# EAGLE schematic EB_Device (EAGLE 9.6.1)
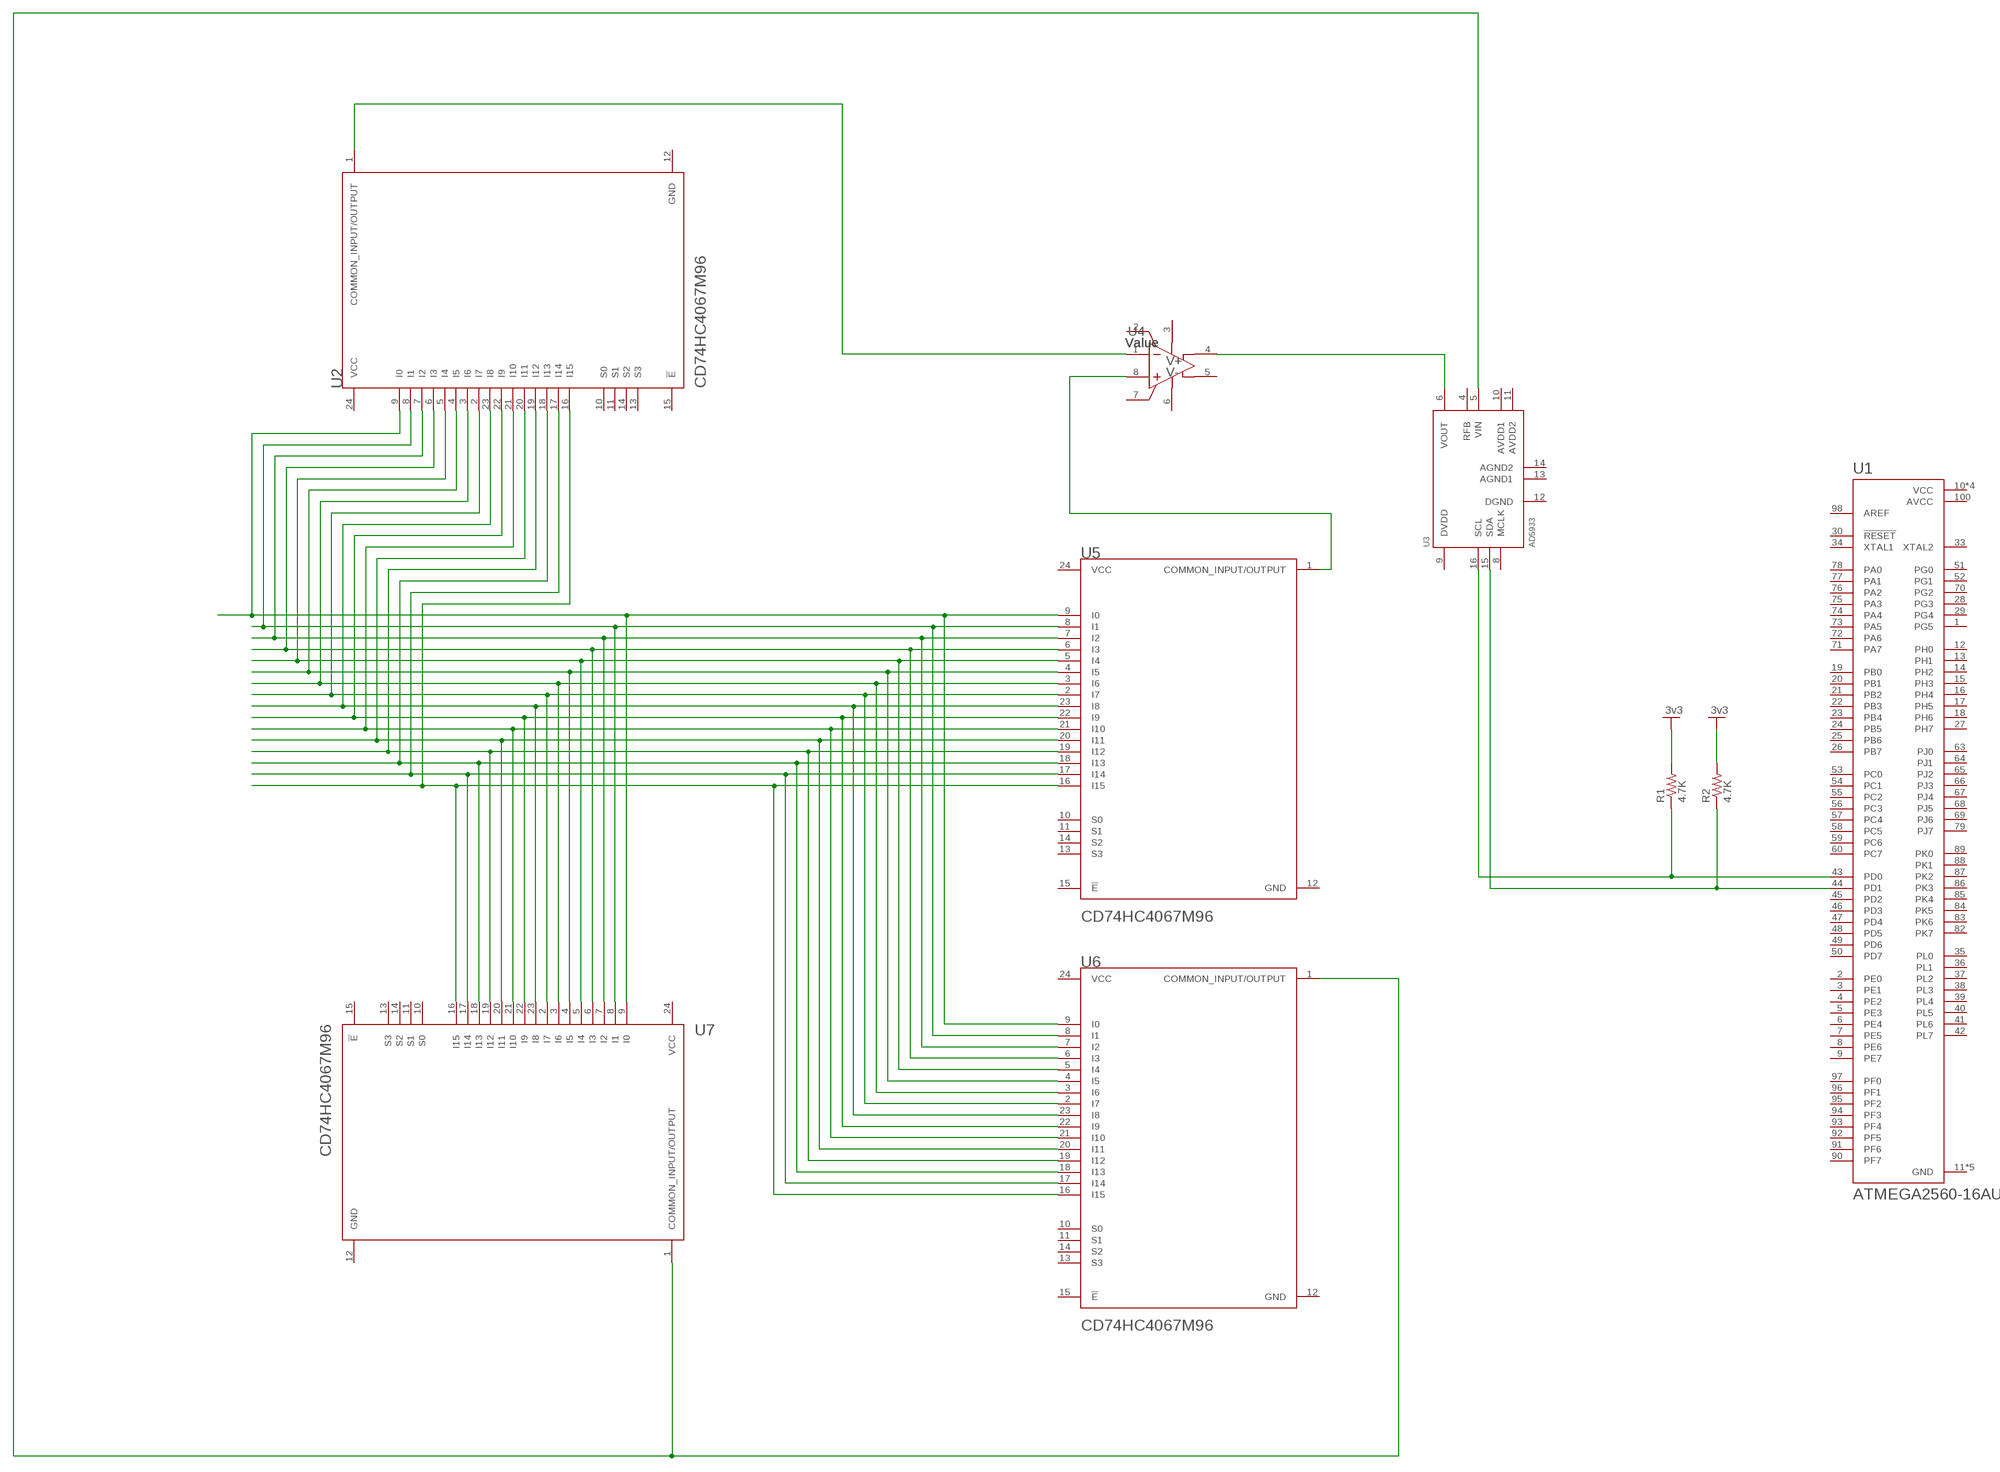
[diagram p0: schematic, sheet 1]

## Parts
R1  4.7K  R-US_0204/2V  [0204V]
R2  4.7K  R-US_0204/2V  [0204V]
U1  ATMEGA2560-16AU  [QFP50P1600X1600X120-100N]
U2  TEXAS_INSTRUMENTS_CD74HC4067M96TEXAS_INSTRUMENTS_CD74HC4067M96_0_0  [TEXAS_INSTRUMENTS_CD74HC4067M96_0]
U3  AD5933  [SSOP16]
U4  Value  THS4561IDGKT  [DGK0008A_N]
U5  TEXAS_INSTRUMENTS_CD74HC4067M96TEXAS_INSTRUMENTS_CD74HC4067M96_0_0  [TEXAS_INSTRUMENTS_CD74HC4067M96_0]
U6  TEXAS_INSTRUMENTS_CD74HC4067M96TEXAS_INSTRUMENTS_CD74HC4067M96_0_0  [TEXAS_INSTRUMENTS_CD74HC4067M96_0]
U7  TEXAS_INSTRUMENTS_CD74HC4067M96TEXAS_INSTRUMENTS_CD74HC4067M96_0_0  [TEXAS_INSTRUMENTS_CD74HC4067M96_0]

## Nets
GND: R1.2 R2.2 ; supply symbol labelled 3v3
N$1: U2.9(I0) U5.9(I0) U6.9(I0) U7.9(I0)
N$2: U2.2(I7) U2.3(I6) U2.4(I5) U2.5(I4) U2.6(I3) U2.7(I2) U2.8(I1) U2.16(I15) U2.17(I14) U2.18(I13) U2.19(I12) U2.20(I11) U2.21(I10) U2.22(I9) U2.23(I8) U5.2(I7) U5.3(I6) U5.4(I5) U5.5(I4) U5.6(I3) U5.7(I2) U5.8(I1) U5.16(I15) U5.17(I14) U5.18(I13) U5.19(I12) U5.20(I11) U5.21(I10) U5.22(I9) U5.23(I8) U6.2(I7) U6.3(I6) U6.4(I5) U6.5(I4) U6.6(I3) U6.7(I2) U6.8(I1) U6.16(I15) U6.17(I14) U6.18(I13) U6.19(I12) U6.20(I11) U6.21(I10) U6.22(I9) U6.23(I8) U7.2(I7) U7.3(I6) U7.4(I5) U7.5(I4) U7.6(I3) U7.7(I2) U7.8(I1) U7.16(I15) U7.17(I14) U7.18(I13) U7.19(I12) U7.20(I11) U7.21(I10) U7.22(I9) U7.23(I8)
N$3: U2.1(COMMON_INPUT/OUTPUT) U4.1(VIN-)
N$4: U4.8(VIN+) U5.1(COMMON_INPUT/OUTPUT)
N$5: U3.6(VOUT) U4.4(VOUT+)
N$6: U3.5(VIN) U6.1(COMMON_INPUT/OUTPUT) U7.1(COMMON_INPUT/OUTPUT)
N$7: R2.1 U1.44(PD1) U3.15(SDA)
N$8: R1.1 U1.43(PD0) U3.16(SCL)
Unconnected: U1.1(PG5) U1.2(PE0) U1.3(PE1) U1.4(PE2) U1.5(PE3) U1.6(PE4) U1.7(PE5) U1.8(PE6) U1.9(PE7) U1.12(PH0) U1.13(PH1) U1.14(PH2) U1.15(PH3) U1.16(PH4) U1.17(PH5) U1.18(PH6) U1.19(PB0) U1.20(PB1) U1.21(PB2) U1.22(PB3) U1.23(PB4) U1.24(PB5) U1.25(PB6) U1.26(PB7) U1.27(PH7) U1.28(PG3) U1.29(PG4) U1.30(!RESET) U1.33(XTAL2) U1.34(XTAL1) U1.35(PL0) U1.36(PL1) U1.37(PL2) U1.38(PL3) U1.39(PL4) U1.40(PL5) U1.41(PL6) U1.42(PL7) U1.45(PD2) U1.46(PD3) U1.47(PD4) U1.48(PD5) U1.49(PD6) U1.50(PD7) U1.51(PG0) U1.52(PG1) U1.53(PC0) U1.54(PC1) U1.55(PC2) U1.56(PC3) U1.57(PC4) U1.58(PC5) U1.59(PC6) U1.60(PC7) U1.63(PJ0) U1.64(PJ1) U1.65(PJ2) U1.66(PJ3) U1.67(PJ4) U1.68(PJ5) U1.69(PJ6) U1.70(PG2) U1.71(PA7) U1.72(PA6) U1.73(PA5) U1.74(PA4) U1.75(PA3) U1.76(PA2) U1.77(PA1) U1.78(PA0) U1.79(PJ7) U1.82(PK7) U1.83(PK6) U1.84(PK5) U1.85(PK4) U1.86(PK3) U1.87(PK2) U1.88(PK1) U1.89(PK0) U1.90(PF7) U1.91(PF6) U1.92(PF5) U1.93(PF4) U1.94(PF3) U1.95(PF2) U1.96(PF1) U1.97(PF0) U1.98(AREF) U2.10(S0) U2.11(S1) U2.13(S3) U2.14(S2) U2.15(!E!) U3.4(RFB) U3.8(MCLK) U3.9(DVDD) U3.10(AVDD1) U3.11(AVDD2) U3.12(DGND) U3.13(AGND1) U3.14(AGND2) U4.2(VOCM) U4.5(VOUT-) U4.7(PD_N) U5.10(S0) U5.11(S1) U5.13(S3) U5.14(S2) U5.15(!E!) U6.10(S0) U6.11(S1) U6.13(S3) U6.14(S2) U6.15(!E!) U7.10(S0) U7.11(S1) U7.13(S3) U7.14(S2) U7.15(!E!)

## Power pins joined to a net without a drawn wire
AVCC: U1.100(AVCC)
GND: U1.11(GND) U1.32(GND) U1.62(GND) U1.81(GND) U1.99(GND) U2.12(GND) U5.12(GND) U6.12(GND) U7.12(GND)
VCC: U1.10(VCC) U1.31(VCC) U1.61(VCC) U1.80(VCC) U2.24(VCC) U5.24(VCC) U6.24(VCC) U7.24(VCC)
VS+: U4.3(VS+)
VS-: U4.6(VS-)

## Library data of the parts
R1 R2 = adafruit:R-US_: RESISTOR, American symbol
U1 = ATMEGA2560-16AU:ATMEGA2560-16AU: ATmega Series 16 MHz 256 KB Flash 8 KB SRAM 8-Bit Microcontroller - TQFP-100 Check prices <https://pricing.snapeda.com/parts/ATMEGA2560-16AU/Microchip/view-part?ref=eda>; AVAILABILITY: Good; DESCRIPTION: AVR AVR® ATmega Microcontroller IC 8-Bit 16MHz 256KB (128K x 16) FLASH 100-TQFP (14x14); MF: Microchip; MP: ATMEGA2560-16AU; PACKAGE: TQFP-100 Microchip; PRICE: None; PURCHASE-URL: https://pricing.snapeda.com/search/part/ATMEGA2560-16AU/?ref=eda
U2 U5-U7 = Texas Instruments - CD74HC4067M96:TEXAS_INSTRUMENTS_CD74HC4067M96: High-speed CMOS 16-channel analog multiplexer/demultiplexer 24-SOIC -55 to 125; AMBIENT_TEMPERATURE_RANGE_HIGH: +125°C; AMBIENT_TEMPERATURE_RANGE_LOW: -55°C; AUTOMOTIVE: No; CENTROID_NOT_SPECIFIED: No; DATASHEET: http://www.ti.com/lit/ds/symlink/cd74hc4067.pdf; DEVICE_CLASS_L1: Integrated Circuits (ICs); DEVICE_CLASS_L2: Logic ICs; DEVICE_CLASS_L3: Multiplexers; DIGIKEY_DESCRIPTION: IC MUX/DEMUX 1X16 24SOIC; DIGIKEY_PART_NUMBER: 296-29408-1-ND; FOOTPRINT_PARAMETERS_1: {"fp_type":"SOIC_narrow","params":{"N":{"nom":24,"long name":"Number of leads","min":null,"max":null,"short name":"N","type":"count"},"A":{"nom":false,"long name":"Height","min":false,"max":2650000,"short name":"A","type":"measurement"},"A1":{"nom":false,"long name":"Package clearance","min":100000,"max":300000,"short name":"A1","type":"measurement"},"A2":{"nom":false,"long name":"Package height","min":false,"max":2550000,"short name":"A2","type":"measurement"},"D":{"nom":false,"long name":"Package length","min":15200000,"max":15600000,"short name":"D","type":"measurement"},"E":{"nom":false,"long name":"Width w/ leads","min":9970000,"max":10630000,"short name":"E","type":"measurement"},"E1":{"nom":false,"long name":"Package width","min":7400000,"max":7600000,"short name":"E1","type":"measurement"},"B":{"nom":false,"long name":"Lead width","min":310000,"max":510000,"short name":"B","type":"measurement"},"C":{"nom":false,"long name":"Lead thickness","min":200000,"max":330000,"short name":"C","type":"measurement"},"e":{"nom":1270000,"long name":"Lead pitch","min":null,"max":null,"short name":"e","type":"measurement"},"L":{"nom":false,"long name":"Lead foot length","min":400000,"max":1270000,"short name":"L","type":"measurement"},"PHI":{"nom":false,"long name":"Lead foot angle","min":0,"max":8000000,"short name":"PHI","type":"measurement"},"HT":{"default":"No","long name":"Thermal pad","type":"multichoiceparent","short name":"HT","children":[]},"offset x":{"nom":0,"long name":"X Center offset","min":null,"max":null,"short name":"offset x","type":"measurement"},"offset y":{"nom":0,"long name":"Y Center offset","min":null,"max":null,"short name":"offset y","type":"measurement"},"LS":{"default":"Rounded rectangle","long name":"Land shape","type":"multichoice","short name":"LS"},"LS1":{"default":"Rectangle","long name":"Land shape (Pin 1)","type":"multichoice","short name":"LS1"},"solder toe":{"nom":550000,"long name":"Solder fillet (toe)","min":null,"max":null,"short name":"solder toe","type":"fixedmeasurement"},"solder heel":{"nom":450000,"long name":"Solder fillet (heel)","min":null,"max":null,"short name":"solder heel","type":"fixedmeasurement"},"solder side":{"nom":50000,"long name":"Solder fillet (side)","min":null,"max":null,"short name":"solder side","type":"fixedmeasurement"},"courtyard":{"nom":500000,"long name":"Courtyard","min":null,"max":null,"short name":"courtyard","type":"fixedmeasurement"},"SF":{"default":"A","long name":"Packing level","type":"multichoiceparent","short name":"SF","help":"http://support.upverter.com/customer/portal/articles/978783-what-is-a-footprint-packing-level","children":["solder toe","solder heel","solder side","courtyard"]}}}; FOOTPRINT_PARAMETERS_2: {"fp_type":"SOIC_narrow","params":{"N":{"nom":24,"long name":"Number of leads","min":null,"max":null,"short name":"N","type":"count"},"A":{"nom":false,"long name":"Height","min":false,"max":2650000,"short name":"A","type":"measurement"},"A1":{"nom":false,"long name":"Package clearance","min":100000,"max":300000,"short name":"A1","type":"measurement"},"A2":{"nom":false,"long name":"Package height","min":false,"max":2550000,"short name":"A2","type":"measurement"},"D":{"nom":false,"long name":"Package length","min":15200000,"max":15600000,"short name":"D","type":"measurement"},"E":{"nom":false,"long name":"Width w/ leads","min":9970000,"max":10630000,"short name":"E","type":"measurement"},"E1":{"nom":false,"long name":"Package width","min":7400000,"max":7600000,"short name":"E1","type":"measurement"},"B":{"nom":false,"long name":"Lead width","min":310000,"max":510000,"short name":"B","type":"measurement"},"C":{"nom":false,"long name":"Lead thickness","min":200000,"max":330000,"short name":"C","type":"measurement"},"e":{"nom":1270000,"long name":"Lead pitch","min":null,"max":null,"short name":"e","type":"measurement"},"L":{"nom":false,"long name":"Lead foot length","min":400000,"max":1270000,"short name":"L","type":"measurement"},"PHI":{"nom":false,"long name":"Lead foot angle","min":0,"max":8000000,"short name":"PHI","type":"measurement"},"HT":{"default":"No","long name":"Thermal pad","type":"multichoiceparent","short name":"HT","children":[]},"offset x":{"nom":0,"long name":"X Center offset","min":null,"max":null,"short name":"offset x","type":"measurement"},"offset y":{"nom":0,"long name":"Y Center offset","min":null,"max":null,"short name":"offset y","type":"measurement"},"LS":{"default":"Rounded rectangle","long name":"Land shape","type":"multichoice","short name":"LS"},"LS1":{"default":"Rectangle","long name":"Land shape (Pin 1)","type":"multichoice","short name":"LS1"},"solder toe":{"nom":350000,"long name":"Solder fillet (toe)","min":null,"max":null,"short name":"solder toe","type":"fixedmeasurement"},"solder heel":{"nom":350000,"long name":"Solder fillet (heel)","min":null,"max":null,"short name":"solder heel","type":"fixedmeasurement"},"solder side":{"nom":30000,"long name":"Solder fillet (side)","min":null,"max":null,"short name":"solder side","type":"fixedmeasurement"},"courtyard":{"nom":250000,"long name":"Courtyard","min":null,"max":null,"short name":"courtyard","type":"fixedmeasurement"},"SF":{"default":"B","long name":"Packing level","type":"multichoiceparent","short name":"SF","help":"http://support.upverter.com/customer/portal/articles/978783-what-is-a-footprint-packing-level","children":["solder toe","solder heel","solder side","courtyard"]}}}; FOOTPRINT_PARAMETERS_3: {"fp_type":"SOIC_narrow","params":{"N":{"nom":24,"long name":"Number of leads","min":null,"max":null,"short name":"N","type":"count"},"A":{"nom":false,"long name":"Height","min":false,"max":2650000,"short name":"A","type":"measurement"},"A1":{"nom":false,"long name":"Package clearance","min":100000,"max":300000,"short name":"A1","type":"measurement"},"A2":{"nom":false,"long name":"Package height","min":false,"max":2550000,"short name":"A2","type":"measurement"},"D":{"nom":false,"long name":"Package length","min":15200000,"max":15600000,"short name":"D","type":"measurement"},"E":{"nom":false,"long name":"Width w/ leads","min":9970000,"max":10630000,"short name":"E","type":"measurement"},"E1":{"nom":false,"long name":"Package width","min":7400000,"max":7600000,"short name":"E1","type":"measurement"},"B":{"nom":false,"long name":"Lead width","min":310000,"max":510000,"short name":"B","type":"measurement"},"C":{"nom":false,"long name":"Lead thickness","min":200000,"max":330000,"short name":"C","type":"measurement"},"e":{"nom":1270000,"long name":"Lead pitch","min":null,"max":null,"short name":"e","type":"measurement"},"L":{"nom":false,"long name":"Lead foot length","min":400000,"max":1270000,"short name":"L","type":"measurement"},"PHI":{"nom":false,"long name":"Lead foot angle","min":0,"max":8000000,"short name":"PHI","type":"measurement"},"HT":{"default":"No","long name":"Thermal pad","type":"multichoiceparent","short name":"HT","children":[]},"offset x":{"nom":0,"long name":"X Center offset","min":null,"max":null,"short name":"offset x","type":"measurement"},"offset y":{"nom":0,"long name":"Y Center offset","min":null,"max":null,"short name":"offset y","type":"measurement"},"LS":{"default":"Rounded rectangle","long name":"Land shape","type":"multichoice","short name":"LS"},"LS1":{"default":"Rectangle","long name":"Land shape (Pin 1)","type":"multichoice","short name":"LS1"},"solder toe":{"nom":150000,"long name":"Solder fillet (toe)","min":null,"max":null,"short name":"solder toe","type":"fixedmeasurement"},"solder heel":{"nom":250000,"long name":"Solder fillet (heel)","min":null,"max":null,"short name":"solder heel","type":"fixedmeasurement"},"solder side":{"nom":10000,"long name":"Solder fillet (side)","min":null,"max":null,"short name":"solder side","type":"fixedmeasurement"},"courtyard":{"nom":100000,"long name":"Courtyard","min":null,"max":null,"short name":"courtyard","type":"fixedmeasurement"},"SF":{"default":"C","long name":"Packing level","type":"multichoiceparent","short name":"SF","help":"http://support.upverter.com/customer/portal/articles/978783-what-is-a-footprint-packing-level","children":["solder toe","solder heel","solder side","courtyard"]}}}; FOOTPRINT_VARIANT_NAME_0: Recommended_Land_Pattern; FOOTPRINT_VARIANT_NAME_1: IPC_A; FOOTPRINT_VARIANT_NAME_2: IPC_B; FOOTPRINT_VARIANT_NAME_3: IPC_C; HEIGHT: 2.65mm; IPC_LAND_PATTERN_NAME: SOIC127P1030X265-24; LEAD_FREE: Yes; LOGIC_FUNCTION_DESC: Non-Inverting; MAX_JUNCTION_TEMP: +150°C; MAX_SUPPLY_VOLTAGE: 6V; MF: Texas Instruments; MFG_PACKAGE_IDENT: DW0024A; MFG_PACKAGE_IDENT_COMPONENT_ID: 7ddb0374575ad7a2; MFG_PACKAGE_IDENT_DATE: 0; MFG_PACKAGE_IDENT_REV: 0; MIN_SUPPLY_VOLTAGE: 2V; MOUSER_DESCRIPTION: Multiplexer Switch ICs Hi-Spd CMOS 16Ch Anl Mltplxr/Demltplxr; MOUSER_PART_NUMBER: 595-CD74HC4067M96; MPN: CD74HC4067M96; NUMBER_OF_CIRCUITS: 1; NUMBER_OF_INPUTS: 16; NUMBER_OF_OUTPUTS: 1; PACKAGE: SOIC24; PREFIX: U; PROPAGATION_DELAY: 6ns; QUIESCENT_CURRENT: 8uA; ROHS: Yes; STANDOFF_HEIGHT: 0.1mm; TEMPERATURE_RANGE_HIGH: +125°C; TEMPERATURE_RANGE_LOW: -55°C; VERIFICATION_VERSION: 0.0.0.3
U3 = kblom:AD5933: 1 MSPS, 12-Bit Impedance Converter, Network Analyzer Applications: Electrochemical analysis Bioelectrical impedance analysis Impedance spectroscopy Complex impedance measurement Corrosion monitoring and protection equipment Biomedical and automotive sensors Proximity sensing Nondestructive testing Material property analysis Fuel/battery cell condition monitoring source <http://www.analog.com/static/imported-files/data_sheets/AD5933.pdf>
U4 = THS4561_DiffAmp:THS4561IDGKT; MANUFACTURER: Texas Instruments; PARTNUMBER: THS4561IDGKR; REFDES: RefDes; TYPE: TYPE